# EAGLE design LED Board (EAGLE 7.2.0)
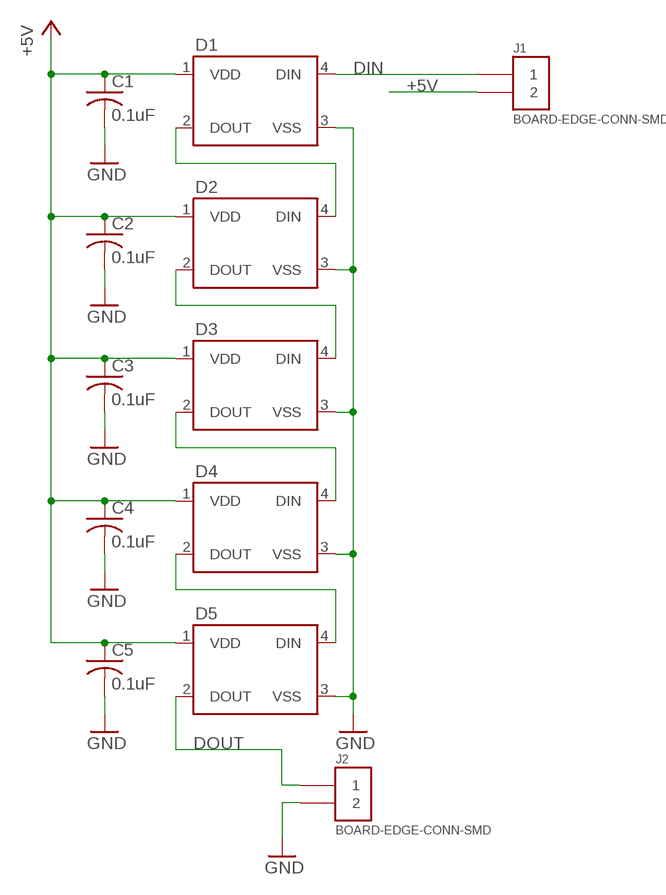
[diagram p0: schematic, sheet 1]

## Parts
C1  0.1uF  C-USC0603  [C0603]
C2  0.1uF  C-USC0603  [C0603]
C3  0.1uF  C-USC0603  [C0603]
C4  0.1uF  C-USC0603  [C0603]
C5  0.1uF  C-USC0603  [C0603]
D1  WS2812B  [WS2812B]
D2  WS2812B  [WS2812B]
D3  WS2812B  [WS2812B]
D4  WS2812B  [WS2812B]
D5  WS2812B  [WS2812B]
J1  BOARD-EDGE-CONN-SMD  [SMD-2]
J2  BOARD-EDGE-CONN-SMD  [SMD-2]

## Nets
+5V: C1.1 C2.1 C3.1 C4.1 C5.1 D1.1(VDD) D2.1(VDD) D3.1(VDD) D4.1(VDD) D5.1(VDD) J1.P$2
DIN: D1.4(DIN) J1.P$1
DOUT: D5.2(DOUT) J2.P$1
GND: C1.2 C2.2 C3.2 C4.2 C5.2 D1.3(VSS) D2.3(VSS) D3.3(VSS) D4.3(VSS) D5.3(VSS) J2.P$2
N$1: D1.2(DOUT) D2.4(DIN)
N$2: D2.2(DOUT) D3.4(DIN)
N$3: D3.2(DOUT) D4.4(DIN)
N$4: D4.2(DOUT) D5.4(DIN)

## Library data of the parts
C1-C5 = resistor:C-US: CAPACITOR, American symbol
D1-D5 = SparkFun-LED:WS2812B: WS2812B - Intelligent control LED integrated light source Technical Specifications: Power Supply Voltage (VDD): 3.5 to 5.3 V Input Voltage (VI): -0.5 to VDD+0.5 V Operating Junction Temperature (Topt): -25°C to +80°C Storage Temperature Range (Tstg): -55°C to +150°C
J1 J2 = Board Edge Solder Connector SMD:BOARD-EDGE-CONN-SMD

## Board
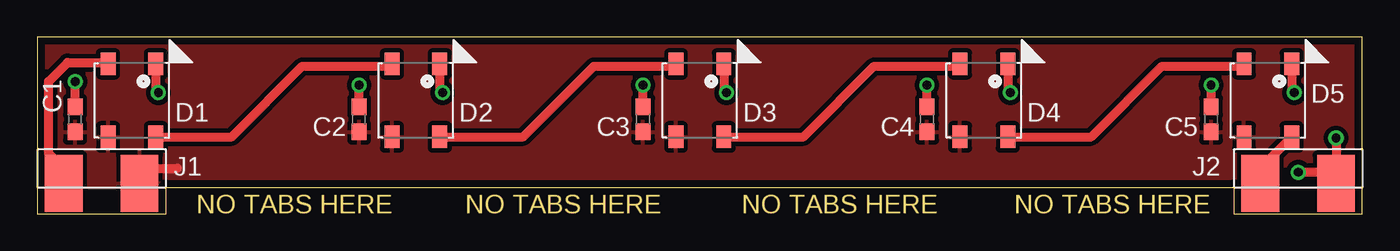
[diagram p1: board, top side]
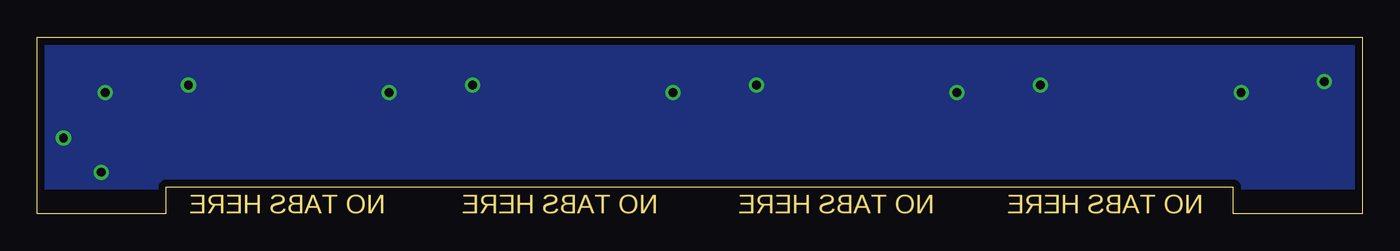
[diagram p2: board, bottom side, seen from below]

Size 88.88 x 11.86 mm. Coordinates in mm from the lower left corner, seen from the top.
Outline: 0,0 8.64,0 8.64,1.78 80.26,1.78 80.26,0 88.88,0 88.88,11.86 0,11.86 0,0
Copper layers (1*16): Top 0.035mm / dielectric 1.5mm / Bottom 0.035mm
Design rules "default *": minimum track width 10mil, minimum drill 24mil, track to track 12mil, track to pad 12mil, pad to pad 8mil, via to via 8mil, smd to smd 8mil, copper to edge 20mil, drill to drill 8mil, minimum pad ring 10mil, minimum via ring 8mil, stop-mask expansion 4mil, vias tented up to drill 0mil, thermal gap 12mil

### Footprints (pad centres in the part's own frame; a part is rotated, then mirrored left to right if it is on the bottom)
C0603 = smd 1.1 x 1: 1 -0.85,0; 2 0.85,0
WS2812B = smd 1.5 x 1: 1 -2.45,1.6; 2 -2.45,-1.6; 3 2.45,-1.6; 4 2.45,1.6
SMD-2 = smd 2.54 x 3.81: P$1 -2.54,0; P$2 2.54,0

### Placement (x,y rotation side)
C1  2.54,6.35 90 top
C2  21.59,6.35 90 top
C3  40.64,6.35 90 top
C4  59.69,6.35 90 top
C5  78.74,6.35 90 top
D1  6.35,7.62 90 top
D2  25.4,7.62 90 top
D3  44.45,7.62 90 top
D4  63.5,7.62 90 top
D5  82.55,7.62 90 top
J1  4.32,2.03 0 top
J2  84.58,2.03 0 top

### Tracks (layer width: path | path; a pad name or v marks a point on that pad's centre or on a via)
+5V
  Top 0.61: J1.P$2 6.86,2.79 7.11,3.05 9.4,3.05
  pour Top: 0,11.68 88.9,11.68 88.9,1.78 0,1.78
DIN
  Top 0.61: J1.P$1 1.78,3.05 0.76,4.06 0.76,8.89 2.03,10.16 4.66,10.16 D1.4
DOUT
  Top 0.61: J2.P$1 82.04,3.06 D5.2
GND  (via drill 0.6)
  Top 0.61: C1.2 v2.54,8.89 | C2.2 v21.59,8.64 | C3.2 v40.64,8.64 | C4.2 v59.69,8.64 | C5.2 v78.74,8.64 | D5.3 84.15,8.31 v84.33,8.13 | D4.3 65.1,8.31 v65.28,8.13 | D3.3 46.05,8.31 v46.23,8.13 | D2.3 27,8.31 v27.18,8.13 | D1.3 7.95,8.31 v8.13,8.13 | J2.P$2 87.12,2.79 | v87.12,5.08 87.12,2.79 | 87.12,2.79 v84.58,2.79
  pour Bottom: 0,11.68 88.9,11.68 88.9,1.78 0,1.78
N$1
  Top 0.61: D1.2 13.04,5.17 17.78,9.91 23.64,9.91 D2.4
N$2
  Top 0.61: D2.2 32.6,5.17 37.34,9.91 42.69,9.91 D3.4
N$3
  Top 0.61: D3.2 51.4,5.17 56.13,9.91 61.74,9.91 D4.4
N$4
  Top 0.61: D4.2 70.7,5.17 75.44,9.91 80.79,9.91 D5.4

### Text on the board
Dimension: NO TABS HERE | NO TABS HERE | NO TABS HERE | NO TABS HERE